# EAGLE design untitled (EAGLE 9.2.2)
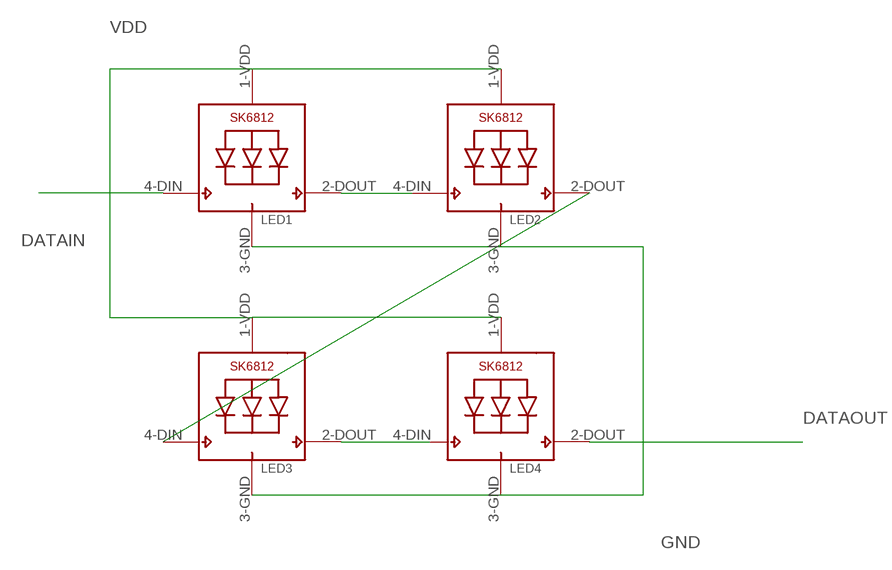
[diagram p0: schematic, sheet 1]

## Parts
LED1  SK6812_5050W  [LED5050_W]
LED2  SK6812_5050W  [LED5050_W]
LED3  SK6812_5050W  [LED5050_W]
LED4  SK6812_5050W  [LED5050_W]

## Nets
DATAIN: LED1.4-DIN(DI)
DATAOUT: LED4.2-DOUT(DO)
GND: LED1.3-GND(GND) LED2.3-GND(GND) LED3.3-GND(GND) LED4.3-GND(GND)
N$2: LED1.2-DOUT(DO) LED2.4-DIN(DI)
N$3: LED2.2-DOUT(DO) LED3.4-DIN(DI)
N$5: LED3.2-DOUT(DO)
VDD: LED1.1-VDD(VDD) LED2.1-VDD(VDD) LED3.1-VDD(VDD) LED4.1-VDD(VDD)
Unconnected: LED4.4-DIN(DI)

## Library data of the parts
LED1-LED4 = SK6812:SK6812

## Board
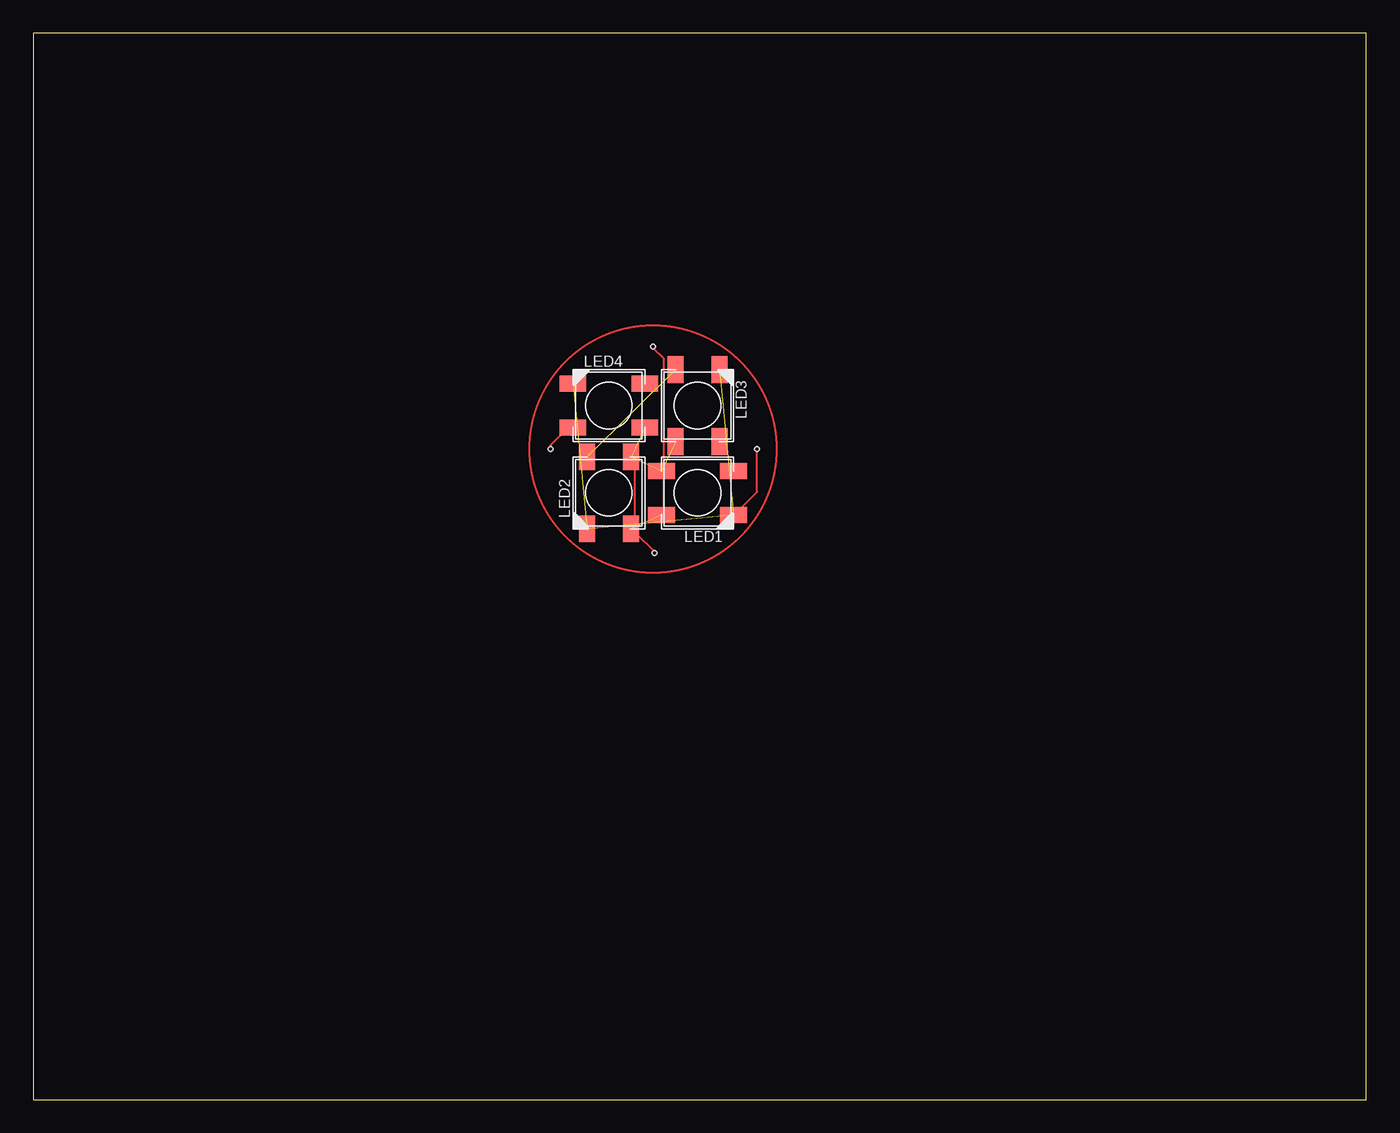
[diagram p1: board, top side]

Size 100 x 80 mm. Coordinates in mm from the lower left corner, seen from the top.
Outline: 0,0 100,0 100,80 0,80 0,0
Copper layers (1*16): Top 0.035mm / dielectric 1.5mm / Bottom 0.035mm
Design rules "default": minimum track width 6mil, minimum drill 0.35mm, track to track 6mil, track to pad 6mil, pad to pad 6mil, via to via 6mil, smd to smd 6mil, copper to edge 40mil, drill to drill 6mil, minimum pad ring 10mil, minimum via ring 8mil, stop-mask expansion 4mil, vias tented up to drill 0mil, thermal gap 10mil
Holes 0.35 mm at 54.3,48.8 46.5,56.5 38.8,48.8 46.6,41

### Footprints (pad centres in the part's own frame; a part is rotated, then mirrored left to right if it is on the bottom)
LED5050_W = smd 2 x 1.2: 1-VDD 2.7,-1.65; 2-DOUT 2.7,1.65; 3-GND -2.7,1.65; 4-DIN -2.7,-1.65

### Placement (x,y rotation side)
LED1  49.83,45.52 180 top
LED2  43.18,45.52 90 top
LED3  49.83,52.07 270 top
LED4  43.18,52.07 0 top

### Tracks (layer width: path | path; a pad name or v marks a point on that pad's centre or on a via)
GND  (3 unrouted)
N$1
  Top 0.152: 45.1,47.6 45.1,42.6 46.7,41
N$2  (1 unrouted)
N$3  (1 unrouted)
N$4
  Top 0.152: 52.4,43.7 54.3,45.6 54.3,48.7
N$6
  Top 0.152: 40.1,50.4 38.8,49.1 38.8,48.8
N$7
  Top 0.152: 47.3,44 47.3,55.6 46.5,56.4
VDD  (3 unrouted)
(copper drawn outside any net)
  shapes: Top circle x1